# Altium schematic sheet MODULE_SAIL_FLASH.SchDoc: MODULE SAIL FLASH
size A3; Author: Silvio Navaretti; CompanyName: ARDUINO; DrawnBy: Silvio Navaretti; Engineer: Silvio Navaretti; Organization: ARDUINO; SheetNumber: 6; SheetTotal: 51; RevAuthor: Silvio Navaretti
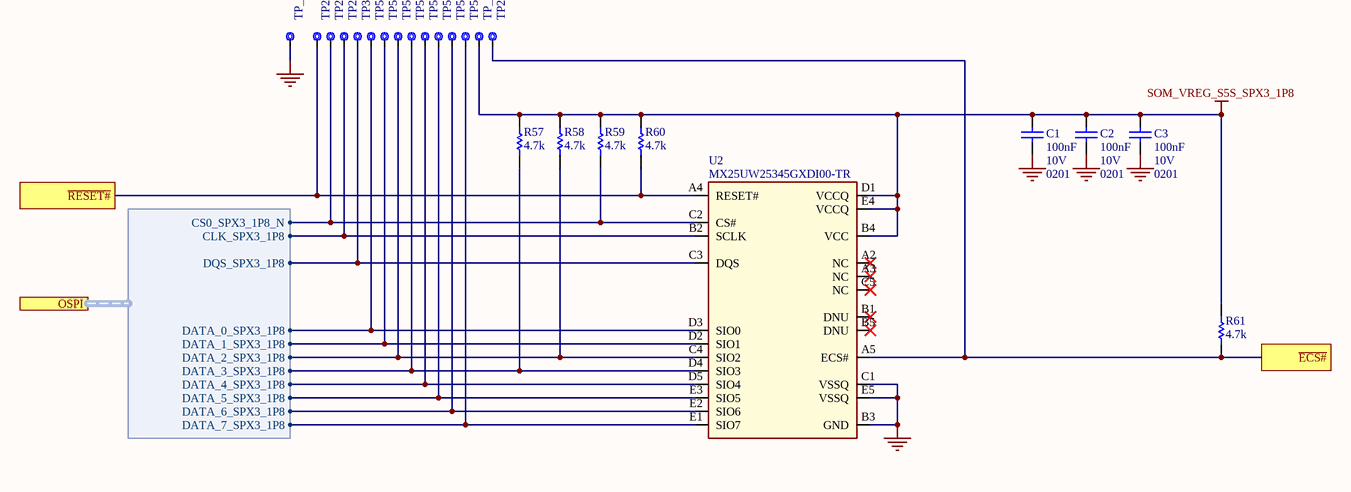
[diagram p0: MODULE_SAIL_FLASH.SchDoc]

## Parts
C1  value 100nF  Voltage: 10V  Case Code (Imperial): 0201  [CAP-0201]  (hidden comment: CL03A104KP3NNNC)
C2  value 100nF  Voltage: 10V  Case Code (Imperial): 0201  [CAP-0201]  (hidden comment: CL03A104KP3NNNC)
C3  value 100nF  Voltage: 10V  Case Code (Imperial): 0201  [CAP-0201]  (hidden comment: CL03A104KP3NNNC)
R57  value 4.7k  [RES-0201]  (hidden comment: RC0201FR-074K7L)
R58  value 4.7k  [RES-0201]  (hidden comment: RC0201FR-074K7L)
R59  value 4.7k  [RES-0201]  (hidden comment: RC0201FR-074K7L)
R60  value 4.7k  [RES-0201]  (hidden comment: RC0201FR-074K7L)
R61  value 4.7k  [RES-0201]  (hidden comment: RC0201FR-074K7L)
TP25  Test point 1.00mm  [TP-1.00MM]  (value not drawn)  (no BOM)
TP26  Test point 1.00mm  [TP-1.00MM]  (value not drawn)  (no BOM)
TP27  Test point 1.00mm  [TP-1.00MM]  (value not drawn)  (no BOM)
TP28  Test point 1.00mm  [TP-1.00MM]  (value not drawn)  (no BOM)
TP31  Test point 1.00mm  [TP-1.00MM]  (value not drawn)  (no BOM)
TP50  Test point 1.00mm  [TP-1.00MM]  (value not drawn)  (no BOM)
TP51  Test point 1.00mm  [TP-1.00MM]  (value not drawn)  (no BOM)
TP52  Test point 1.00mm  [TP-1.00MM]  (value not drawn)  (no BOM)
TP53  Test point 1.00mm  [TP-1.00MM]  (value not drawn)  (no BOM)
TP54  Test point 1.00mm  [TP-1.00MM]  (value not drawn)  (no BOM)
TP55  Test point 1.00mm  [TP-1.00MM]  (value not drawn)  (no BOM)
TP56  Test point 1.00mm  [TP-1.00MM]  (value not drawn)  (no BOM)
TP57  Test point 1.00mm  [TP-1.00MM]  (value not drawn)  (no BOM)
TP_FLASH_SAIL_1V8  Test point 1.00mm  [TP-1.00MM]  (value not drawn)  (no BOM)
TP_FLASH_SAIL_GND  Test point 1.00mm  [TP-1.00MM]  (value not drawn)  (no BOM)
U2  MX25UW25345GXDI00-TR  [MX25UW25345GXDI00-TR]

## Ports
OSPI (harness SOM_SAIL_QSPI0), ~{ECS#}, ~{RESET#}

## Harnesses
SOM_SAIL_QSPI0: DATA_0_SPX3_1P8, DATA_1_SPX3_1P8, DATA_2_SPX3_1P8, DATA_3_SPX3_1P8, DATA_4_SPX3_1P8, DATA_5_SPX3_1P8, DATA_6_SPX3_1P8, DATA_7_SPX3_1P8, CS0_SPX3_1P8_N, CLK_SPX3_1P8, DQS_SPX3_1P8

## Nets
GND: C1.1 C2.1 C3.1 TP_FLASH_SAIL_GND.X U2.B3(GND) U2.C1(VSSQ) U2.E5(VSSQ)
SOM_VREG_S5S_SPX3_1P8: C1.2 C2.2 C3.2 R57.2 R58.2 R59.2 R60.2 R61.2 TP_FLASH_SAIL_1V8.X U2.B4(VCC) U2.D1(VCCQ) U2.E4(VCCQ)
~{ECS#}: R61.1 TP25.X U2.A5(ECS#) ; port ~{ECS#}
~{RESET#}: R60.1 TP26.X U2.A4(RESET#) ; port ~{RESET#}
NetR57_1: R57.1 TP53.X U2.D4(SIO3) ; port OSPI.DATA_3_SPX3_1P8
NetR58_1: R58.1 TP52.X U2.C4(SIO2) ; port OSPI.DATA_2_SPX3_1P8
NetR59_1: R59.1 TP27.X U2.C2(CS#) ; port OSPI.CS0_SPX3_1P8_N
NetTP28_X: TP28.X U2.B2(SCLK) ; port OSPI.CLK_SPX3_1P8
NetTP31_X: TP31.X U2.C3(DQS) ; port OSPI.DQS_SPX3_1P8
NetTP50_X: TP50.X U2.D3(SIO0) ; port OSPI.DATA_0_SPX3_1P8
NetTP51_X: TP51.X U2.D2(SIO1) ; port OSPI.DATA_1_SPX3_1P8
NetTP54_X: TP54.X U2.D5(SIO4) ; port OSPI.DATA_4_SPX3_1P8
NetTP55_X: TP55.X U2.E3(SIO5) ; port OSPI.DATA_5_SPX3_1P8
NetTP56_X: TP56.X U2.E2(SIO6) ; port OSPI.DATA_6_SPX3_1P8
NetTP57_X: TP57.X U2.E1(SIO7) ; port OSPI.DATA_7_SPX3_1P8

Not connected (* = marked no-connect by the designer): U2 A2(NC)* A3(NC)* B1(DNU)* B5(DNU)* C5(NC)*

## Notes on the sheet
- Title:
- ID:
- Date:
- Time:
- Version:
- Sheet
- of
- RevAuthor:
- Reference Designs ARE PROVIDED "AS IS" AND "WITH ALL FAULTS. Arduino SA DISCLAIMS ALL OTHER WARRANTIES, EXPRESS OR IMPLIED, REGARDING PRODUCTS, INCLUDING BUT NOT LIMITED TO, ANY IMPLIED WARRANTIES OF MERCHANTABILITY OR FITNESS FOR A PARTICULAR PURPOSE.
  Arduino SA may make changes to specifications and product descriptions at any time, without notice. The Customer must not rely on the absence or characteristics of any features or instructions marked "reserved" or "undefined".
  Arduino SA reserves these for future definition and shall have no responsibility whatsoever for conflicts or incompatibilities arising from future changes to them. The product information on the Web Site or Materials is subject to change without notice.
  Do not finalize a design with this info. ARDUINO and other Arduino brands and logos and Trademarks of Arduino SA. All Arduino SA Trademarks cannot be used without owner's formal permission.
- File:
- Author:

## Library data of the parts
C1-C3 = C0113-A.6: CAP CHIP 0201 100nF 10% 10V X5R; Manufacturer: Samsung Electro-Mechanics; Code Arduino: C0113; Technology: Ceramic; Part Number: CL03A104KP3NNNC; Dielectric: X5R; Tolerance: 10%
R57-R61 = R0151-A.21: RES CHIP 0201 4k7 1% 1/20W; Manufacturer: Yageo; Temperature coefficient: 200ppm; Power: 50mW; Code Arduino: A5521; Technology: Thick film; Case Code (Imperial): 0201; Part Number: RC0201FR-074K7L; Tolerance: 1%
TP25-TP28 TP31 TP50-TP57 TP_FLASH_SAIL_1V8 TP_FLASH_SAIL_GND = UT0013-A.6: Part Number: This is not a component; Design Item ID: CMP-018-0005-A.3; Source: ut.SchLib; Manufacturer: This is not a component; Code Arduino: This is not a component; Pin Count: 1
U2 = U0506-A.2: IC NOR FLASH, VDD 1.8V, OSPI, 256Mb x1/x8, BGA24 6x8mm; Manufacturer: Macronix; Code Arduino: U0506; Part Number: MX25UW25345GXDI00-TR